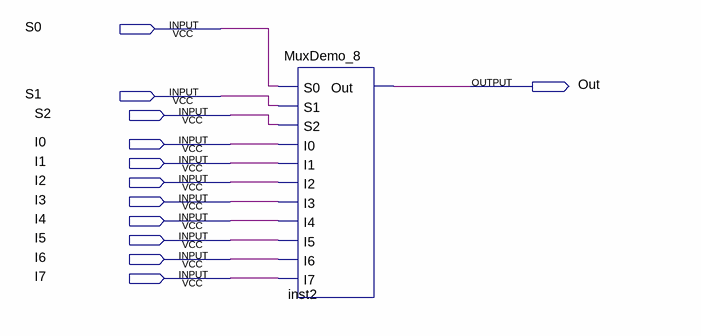
[diagram p0: schematic sheet]
// Quartus schematic MUX_8_1.bdf as structural Verilog: 1 symbols, 12 pins
module MUX_8_1 (
  input  S0,
  input  S1,
  input  S2,
  input  I0,
  input  I1,
  input  I2,
  input  I3,
  input  I4,
  input  I5,
  input  I6,
  input  I7,
  output Out
);

  MuxDemo_8 inst2 (
    .S0(S0), .S1(S1), .S2(S2), .I0(I0), .I1(I1), .I2(I2), .I3(I3), .I4(I4), .I5(I5), .I6(I6), .I7(I7),
    .Out(Out));
endmodule
